# Altium schematic sheet CH32F203VCT6-R0.SchDoc
size 332 x 281 mm
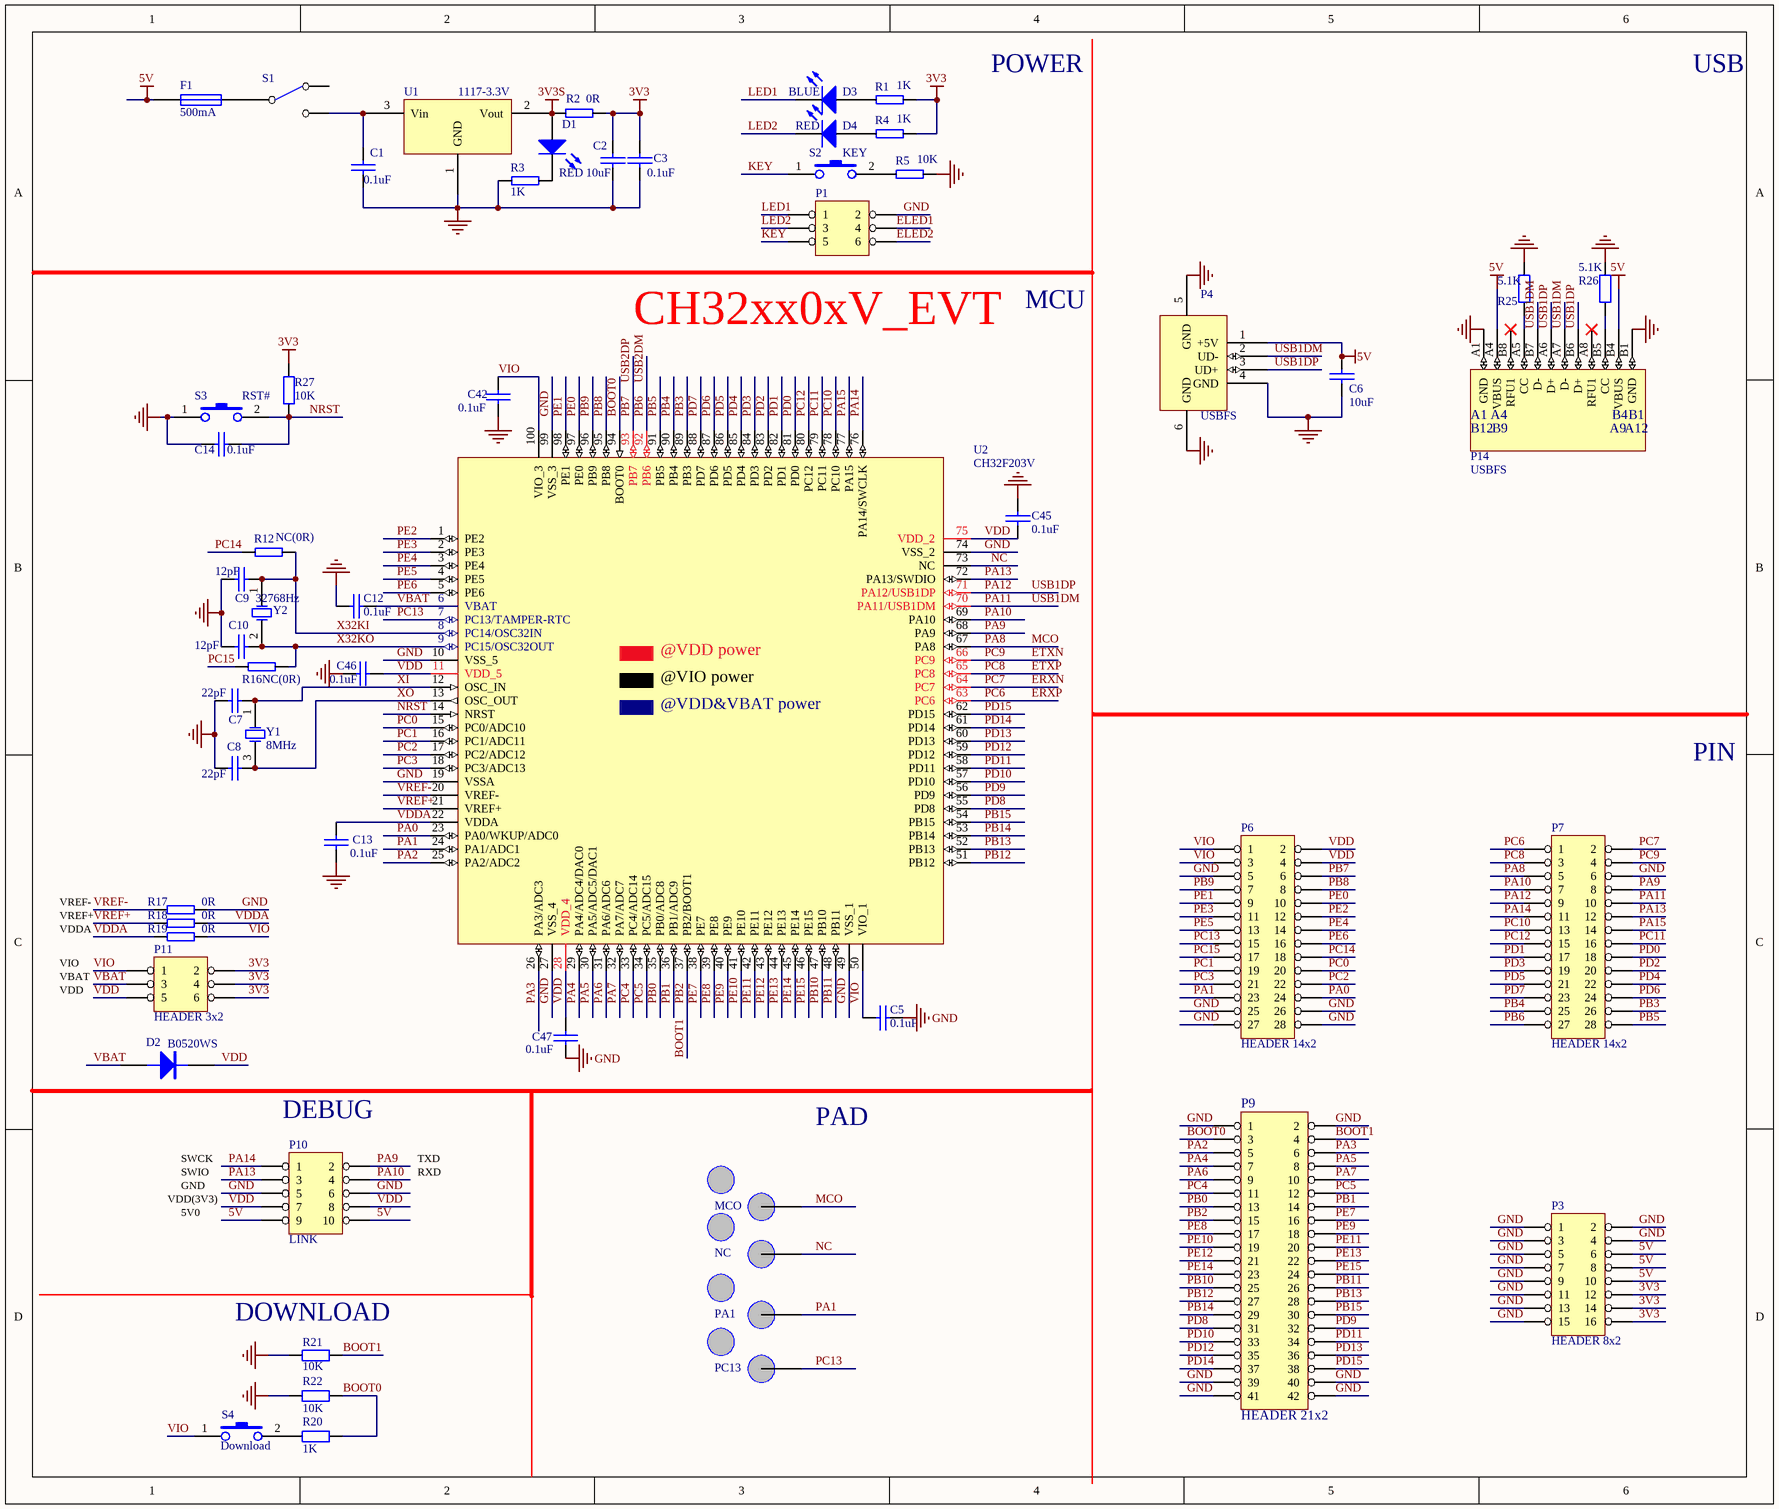
[diagram p0: CH32F203VCT6-R0.SchDoc]

## Parts
C1  0.1uF  [0603_C]
C2  10uF  [3216_C]
C3  0.1uF  [0603_C]
C5  0.1uF  [0603_C]
C6  10uF  [3216_C]
C7  22pF  [0603_C]
C8  22pF  [0603_C]
C9  12pF  [0603_C]
C10  12pF  [0603_C]
C12  0.1uF  [0603_C]
C13  0.1uF  [0603_C]
C14  0.1uF  [0603_C]
C42  0.1uF  [0603_C]
C45  0.1uF  [0603_C]
C46  0.1uF  [0603_C]
C47  0.1uF  [0603_C]
D1  RED  [0603+]
D2  B0520WS  [SOD-323]
D3  BLUE  [0603+]
D4  RED  [0603+]
F1  500mA  [0805]
MCO  Testpoint  [TESTPOINT1]  (value not drawn)
NC  Testpoint  [TESTPOINT1]  (value not drawn)
P1  IO  [IDC6-2.54mm]  (value not drawn)
P3  HEADER 8x2  [IDC16-2.54mm]
P4  USBFS  [USBAF]
P6  HEADER 14x2  [IDC28-2.54MM]
P7  HEADER 14x2  [IDC28-2.54MM]
P9  HEADER 21x2  [IDC42-2.54MM]
P10  LINK  [IDC10-2.54mm]
P11  HEADER 3x2  [IDC6-2.54mm]
P14  USBFS  [TYPE-C-Receptacle-2.0]
PA1  Testpoint  [TESTPOINT1]  (value not drawn)
PC13  Testpoint  [TESTPOINT1]  (value not drawn)
R1  1K  [0603]
R2  0R  [0603]
R3  1K  [0603]
R4  1K  [0603]
R5  10K  [0603]
R12  NC(0R)  [0603]
R16  NC(0R)  [0603]
R17  0R  [0603]
R18  0R  [0603]
R19  0R  [0603]
R20  1K  [0603]
R21  10K  [0603]
R22  10K  [0603]
R25  5.1K  [0603]
R26  5.1K  [0603]
R27  10K  [0603]
S1  SW SPDT  [KEY2]  (value not drawn)
S2  KEY  [SMD_6.1x3.65x2.5mm-KEY]
S3  RST#  [SMD_6.1x3.65x2.5mm-KEY]
S4  Download  [SMD_6.1x3.65x2.5mm-KEY]
U1  1117-3.3V  [SOT-223]
U2  CH32F203V  [LQFP100]
Y1  8MHz  [XT3225]
Y2  32768Hz  [FC-135]

## Nets
3V3: C2.1 C3.1 P3.12 P3.14 P3.16 P11.2 P11.4 P11.6 R1.1 R2.1 R4.1 R27.2
3V3S: D1.1(A) R2.2 U1.2(Vout)
5V: C6.1 F1.1 P3.6 P3.8 P3.10 P4.1(+5V) P10.9 P10.10 P14.A4(VBUS) P14.B4(VBUS)
GND: C1.2 C2.2 C3.2 C5.2 C6.2 C7.1 C8.1 C9.1 C10.1 C12.1 C13.2 C14.1 C42.1 C45.2 C46.2 C47.1 P1.2 P3.1 P3.2 P3.3 P3.4 P3.5 P3.7 P3.9 P3.11 P3.13 P3.15 P4.4(GND) P4.5(GND) P4.6(GND) P6.5 P6.25 P6.26 P6.27 P6.28 P7.6 P9.1 P9.2 P9.39 P9.40 P9.41 P9.42 P10.5 P10.6 P14.A1(GND) P14.B1(GND) R3.2 R5.1 R17.1 R21.2 R22.2 R25.2 R26.2 S3.1 U1.1(GND) U2.10(VSS_5) U2.19(VSSA) U2.27(VSS_4) U2.49(VSS_1) U2.74(VSS_2) U2.99(VSS_3)
BOOT0: P9.3 R20.1 R22.1 U2.94(BOOT0)
BOOT1: P9.4 P9.15 R21.1 U2.37(PB2/BOOT1)  [also labelled PB2]
ELED1: P1.4
ELED2: P1.6
ERXN: P7.2 U2.64(PC7)  [also labelled PC7]
ERXP: P7.1 U2.63(PC6)  [also labelled PC6]
ETXN: P7.4 U2.66(PC9)  [also labelled PC9]
ETXP: P7.3 U2.65(PC8)  [also labelled PC8]
KEY: P1.5 S2.1
LED1: D3.2(K) P1.1
LED2: D4.2(K) P1.3
MCO: MCO.1(point) P7.5 U2.67(PA8)  [also labelled PA8]
NC: NC.1(point) U2.73(NC)
NRST: C14.2 R27.1 S3.2 U2.14(NRST)
PA0: P6.24 U2.23(PA0/WKUP/ADC0)
PA1: P6.23 PA1.1(point) U2.24(PA1/ADC1)
PA2: P9.5 U2.25(PA2/ADC2)
PA3: P9.6 U2.26(PA3/ADC3)
PA4: P9.7 U2.29(PA4/ADC4/DAC0)
PA5: P9.8 U2.30(PA5/ADC5/DAC1)
PA6: P9.9 U2.31(PA6/ADC6)
PA7: P9.10 U2.32(PA7/ADC7)
PA9: P7.8 P10.2 U2.68(PA9)
PA10: P7.7 P10.4 U2.69(PA10)
PA11: P4.2(UD-) P7.10 P14.A7(D-) P14.B7(D-) U2.70(PA11/USB1DM)  [also labelled USB1DM]
PA12: P4.3(UD+) P7.9 P14.A6(D+) P14.B6(D+) U2.71(PA12/USB1DP)  [also labelled USB1DP]
PA13: P7.12 P10.3 U2.72(PA13/SWDIO)
PA14: P7.11 P10.1 U2.76(PA14/SWCLK)
PA15: P7.14 U2.77(PA15)
PB0: P9.13 U2.35(PB0/ADC8)
PB1: P9.14 U2.36(PB1/ADC9)
PB3: P7.26 U2.89(PB3)
PB4: P7.25 U2.90(PB4)
PB5: P7.28 U2.91(PB5)
PB6: P7.27 U2.92(PB6)  [also labelled USB2DM]
PB7: P6.6 U2.93(PB7)  [also labelled USB2DP]
PB8: P6.8 U2.95(PB8)
PB9: P6.7 U2.96(PB9)
PB10: P9.25 U2.47(PB10)
PB11: P9.26 U2.48(PB11)
PB12: P9.27 U2.51(PB12)
PB13: P9.28 U2.52(PB13)
PB14: P9.29 U2.53(PB14)
PB15: P9.30 U2.54(PB15)
PC0: P6.20 U2.15(PC0/ADC10)
PC1: P6.19 U2.16(PC1/ADC11)
PC2: P6.22 U2.17(PC2/ADC12)
PC3: P6.21 U2.18(PC3/ADC13)
PC4: P9.11 U2.33(PC4/ADC14)
PC5: P9.12 U2.34(PC5/ADC15)
PC10: P7.13 U2.78(PC10)
PC11: P7.16 U2.79(PC11)
PC12: P7.15 U2.80(PC12)
PC13: P6.15 PC13.1(point) U2.7(PC13/TAMPER-RTC)
PC14: P6.18 R12.1
PC15: P6.17 R16.1
PD0: P7.18 U2.81(PD0)
PD1: P7.17 U2.82(PD1)
PD2: P7.20 U2.83(PD2)
PD3: P7.19 U2.84(PD3)
PD4: P7.22 U2.85(PD4)
PD5: P7.21 U2.86(PD5)
PD6: P7.24 U2.87(PD6)
PD7: P7.23 U2.88(PD7)
PD8: P9.31 U2.55(PD8)
PD9: P9.32 U2.56(PD9)
PD10: P9.33 U2.57(PD10)
PD11: P9.34 U2.58(PD11)
PD12: P9.35 U2.59(PD12)
PD13: P9.36 U2.60(PD13)
PD14: P9.37 U2.61(PD14)
PD15: P9.38 U2.62(PD15)
PE0: P6.10 U2.97(PE0)
PE1: P6.9 U2.98(PE1)
PE2: P6.12 U2.1(PE2)
PE3: P6.11 U2.2(PE3)
PE4: P6.14 U2.3(PE4)
PE5: P6.13 U2.4(PE5)
PE6: P6.16 U2.5(PE6)
PE7: P9.16 U2.38(PE7)
PE8: P9.17 U2.39(PE8)
PE9: P9.18 U2.40(PE9)
PE10: P9.19 U2.41(PE10)
PE11: P9.20 U2.42(PE11)
PE12: P9.21 U2.43(PE12)
PE13: P9.22 U2.44(PE13)
PE14: P9.23 U2.45(PE14)
PE15: P9.24 U2.46(PE15)
VBAT: C12.2 D2.1(A) P11.3 U2.6(VBAT)
VDD: C45.1 C46.1 C47.2 D2.2(K) P6.2 P6.4 P10.7 P10.8 P11.5 U2.11(VDD_5) U2.28(VDD_4) U2.75(VDD_2)
VDDA: C13.1 R18.1 R19.2 U2.22(VDDA)
VIO: C5.1 C42.2 P6.1 P6.3 P11.1 R19.1 S4.1 U2.50(VIO_1) U2.100(VIO_3)
VREF+: R18.2 U2.21(VREF+)
VREF-: R17.2 U2.20(VREF-)
X32KI: C9.2 R12.2 U2.8(PC14/OSC32IN) Y2.1(OSC1)
X32KO: C10.2 R16.2 U2.9(PC15/OSC32OUT) Y2.2(OSC2)
XI: C7.2 U2.12(OSC_IN) Y1.1(OSC1)
XO: C8.2 U2.13(OSC_OUT) Y1.3(OSC2)
NetC1_1: C1.1 S1.2(NC) U1.3(Vin)
NetD1_2: D1.2(K) R3.1
NetD3_1: D3.1(A) R1.2
NetD4_1: D4.1(A) R4.2
NetF1_2: F1.2 S1.1(COMMON)
NetP14_A5: P14.A5(CC) R25.1
NetP14_B5: P14.B5(CC) R26.1
NetR5_2: R5.2 S2.2
NetR20_2: R20.2 S4.2

Not connected (* = marked no-connect by the designer): P14 A8(RFU1)* B8(RFU1)*; S1 3(NO)

## Notes on the sheet
- POWER
- USB
- MCU
- (near P1) CH32xx0xV_EVT
- PIN
- VREF-
- VREF+
- VDDA
- VIO
- VBAT
- VDD
- (near P10) DEBUG
- PAD
- SWCK
- SWIO
- GND
- TXD
- RXD
- VDD(3V3)
- 5V0
- (near R21) DOWNLOAD
- (in symbol CH32F203V) @VDD power; @VIO power; @VDD&VBAT power
- (in symbol TYPE-C1) B12; B9; A9; A12

## Library data of the parts
C1-C3 C5-C10 C12-C14 C42 C45-C47 = CAP: Capacitor
D1 D3 D4 = LED0: Typical INFRARED GaAs LED; Published: 8-Jun-2000; LatestRevisionDate: 08-Jul-2005; LatestRevisionNote: Mech Layer 1 removed.; PackageReference: LED-0; Publisher: Altium Limited; PackageDescription: LED; 2 Leads
D2 = DIODE
F1 = FUSE1: Fuse
MCO NC PA1 PC13 = Testpoint: 测试点
P1 P11 = HEADER 3x2: Header, 3-Pin, Dual row
P3 = HEADER 8x2: Header, 8-Pin, Dual row
P4 = USB: USB Port
P6 P7 = HEADER 14x2: Header, 14-Pin, Dual row
P9 = HEADER 21x2: Header, 21-Pin, Dual row
P10 = HEADER 5x2: Header, 5-Pin, Dual row
P14 = TYPE-C1
R1-R5 R12 R16 = RES
R17-R19 = R
R20-R22 R25-R27 = Res2: Resistor
  R20: Published: 8-Jun-2000; LatestRevisionDate: 17-Jul-2002; LatestRevisionNote: Re-released for DXP Platform.; PackageReference: AXIAL-0.4; Publisher: Altium Limited
  R21 R22 R27: Published: 8-Jun-2000; LatestRevisionDate: 17-Jul-2002; LatestRevisionNote: Re-released for DXP Platform.; PackageReference: AXIAL-0.4; Publisher: Altium Limited; Value: 10K
S2-S4 = KEY1
U2 = CH32F203V: ARM M3 HD-MCU, 144MHz, 8*UART, 10*Timer, 4*OPA
Y1 Y2 = XTAL: Crystal Oscillator; Published: 8-Jun-2000; LatestRevisionDate: 17-Jul-2002; LatestRevisionNote: Re-released for DXP Platform.; PackageReference: R38; Publisher: Altium Limited; PackageDescription: Crystal, Thru-Hole; 2 Leads; Body 3.1 x 8.2 mm (Dia.xH)